# EAGLE design rev2 (EAGLE 5.11)
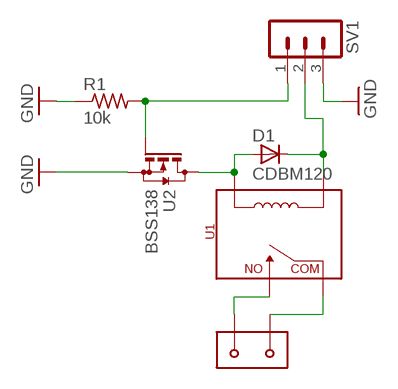
[diagram p0: schematic, sheet 1]

## Parts
D1  CDBM120  D-SMB  [SMB]
R1  10k  R-US_R0805  [R0805]
SV1  MA03-1  [MA03-1]
U1  JVN1A  [JVN1A]
U2  BSS138  [SOT23]
U$3  A98076-ND  [A98076-ND]

## Nets
GND: R1.1 SV1.3 U2.2(S)
N$1: R1.2 SV1.1 U2.1(G)
N$4: U1.NO U$3.P$1
N$5: D1.1(C) SV1.2 U1.C1
N$6: D1.2(A) U1.C2 U2.3(D)
N$7: U1.COM U$3.P$2

## Library data of the parts
D1 = semicon-smd-ipc:D-: DIODE unfilled
R1 = resistor:R-US_: RESISTOR, American symbol
SV1 = con-lstb:MA03-1: PIN HEADER
U1 = JVN1A:JVN1A
U2 = WASP:BSS138
U$3 = A98076-ND:A98076-ND

## Board
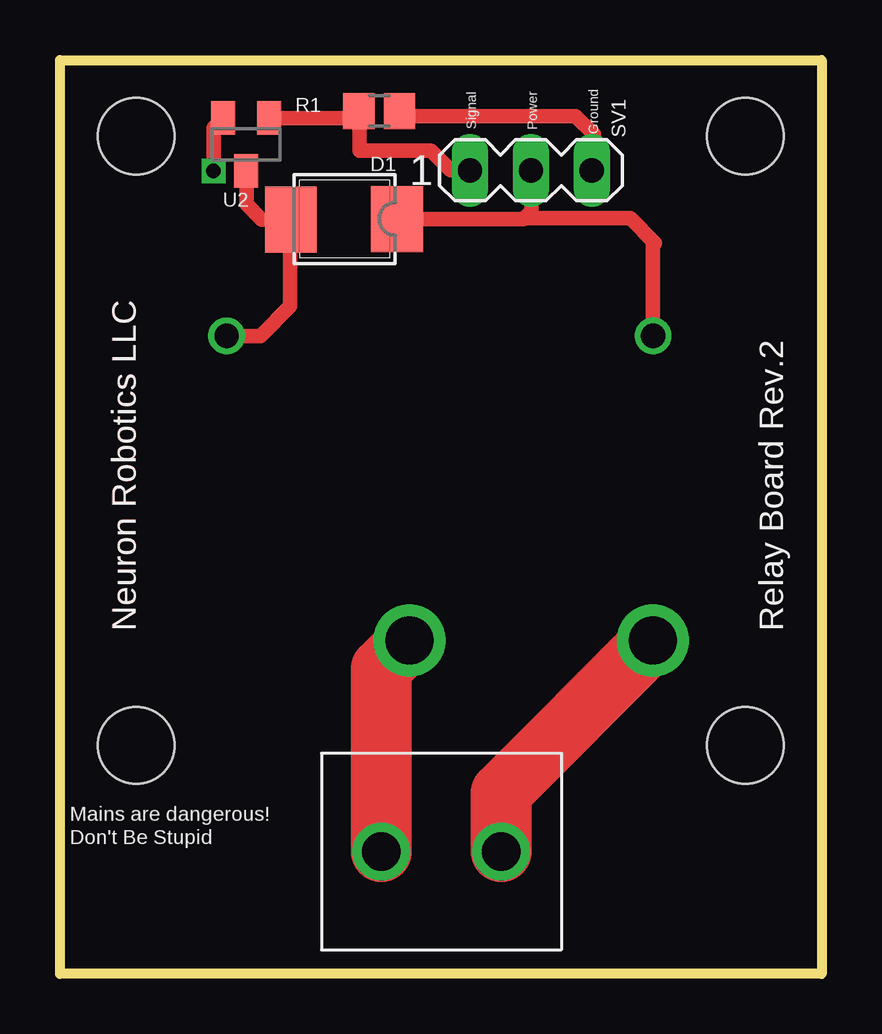
[diagram p1: board, top side]
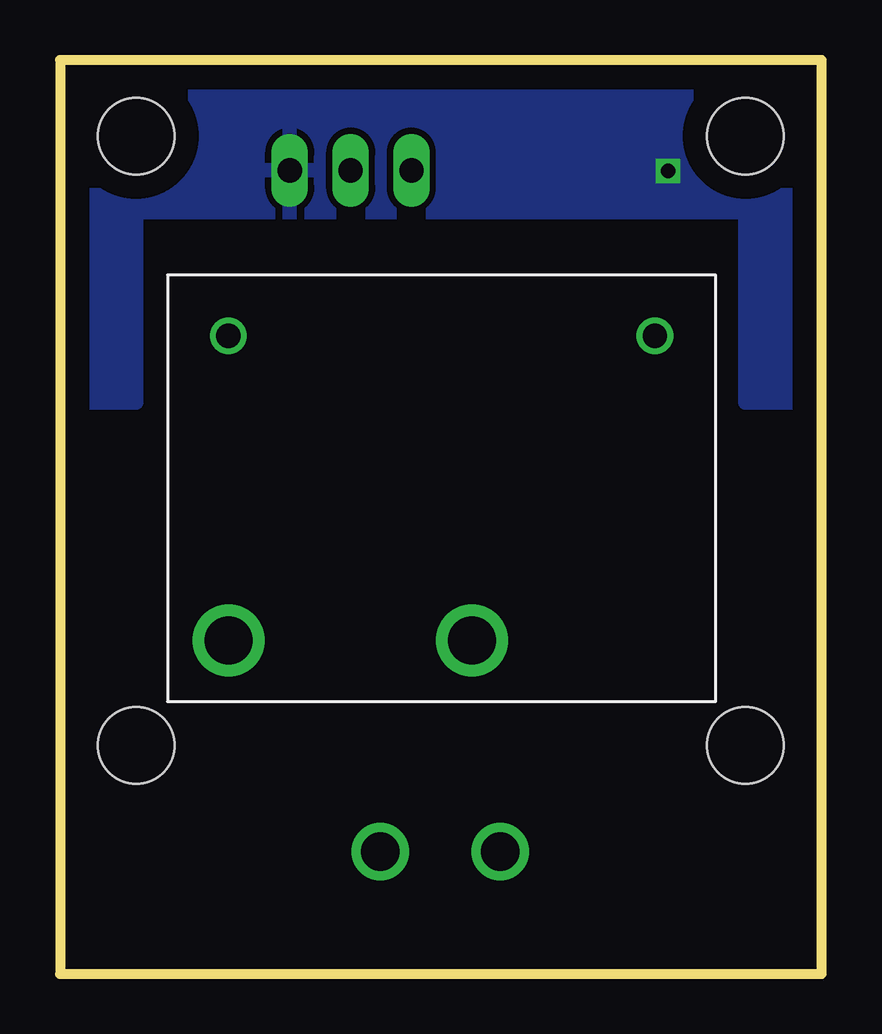
[diagram p2: board, bottom side, seen from below]

Size 31.75 x 38.1 mm. Coordinates in mm from the lower left corner, seen from the top.
Outline: 0,0 0,38.1 31.75,38.1 31.75,0 0,0
Copper layers (1*16): Top 0.035mm / dielectric 1.5mm / Bottom 0.035mm
Design rules "default": minimum track width 10mil, minimum drill 24mil, track to track 8mil, track to pad 8mil, pad to pad 8mil, via to via 8mil, smd to smd 8mil, copper to edge 40mil, drill to drill 8mil, minimum pad ring 10mil, minimum via ring 8mil, stop-mask expansion 4mil, vias tented up to drill 0mil, thermal gap 10mil
Holes 3.2 mm at 3.17,34.92 28.57,34.92 28.57,9.53 3.17,9.53

### Footprints (pad centres in the part's own frame; a part is rotated, then mirrored left to right if it is on the bottom)
SMB = smd 2.159 x 2.743: 1 -2.311,-0.127; 2 2.108,-0.102
R0805 = smd 1.3 x 1.5: 1 -0.85,0; 2 0.85,0
MA03-1 = drill 1.016 long: 1 -2.54,0; 2 0,0; 3 2.54,0
JVN1A = drill 1.016 round: C1 0,12.7; C2 17.78,12.7 | drill 2 round: COM 0,0; NO 10.16,0
SOT23 = smd 1 x 1.4: 1 -0.95,-1.1; 2 0.95,-1.1; 3 0,1.1
A98076-ND = drill 1.6 round: P$1 0,0; P$2 5,0

### Placement (x,y rotation side)
D1  11.73,31.34 180 top
R1  13.31,35.97 180 top
SV1  19.63,33.5 0 top
U1  24.73,13.89 0 bottom
U2  7.76,34.58 180 top
U$3  13.4,5.11 0 top

### Tracks (layer width: path | path; a pad name or v marks a point on that pad's centre or on a via)
GND  (via drill 0.6)
  Top 0.61: R1.1 14.36,35.76 21.49,35.76 22.25,35 22.25,33.58 SV1.3 | U2.2 6.4,35.27 v6.4,33.48
  pour Bottom (isolate 0.254): 0,38.1 0,23.81 3.17,23.81 3.17,31.75 28.57,31.75 28.57,23.81 31.75,23.81 31.75,38.1
N$1
  Top 0.61: SV1.1 16.27,33.5 15.46,34.31 12.5,34.31 12.5,35.93 R1.2 12.18,35.68 U2.1
N$4
  Top 2.54: U$3.P$1 13.4,12.72 U1.NO
N$5
  Top 0.61: D1.1 19.33,31.47 19.36,31.5 | 19.36,31.5 19.66,31.8 19.66,33.48 SV1.2 | 19.36,31.5 23.77,31.5 24.8,30.47 24.73,30.39 U1.C1
N$6
  Top 0.61: U1.C2 8.36,26.59 9.6,27.84 9.6,31.42 D1.2 8.41,31.45 7.77,32.08 7.77,33.47 U2.3
N$7
  Top 2.54: U1.COM 18.4,7.57 U$3.P$2

### Text on the board
Top: Neuron Robotics LLC
tPlace: Signal | Power | Ground | Neuron Robotics LLC | Relay Board Rev.2 | Mains are dangerous! | Don't Be Stupid